# EAGLE schematic e44 (EAGLE 9.5.2)
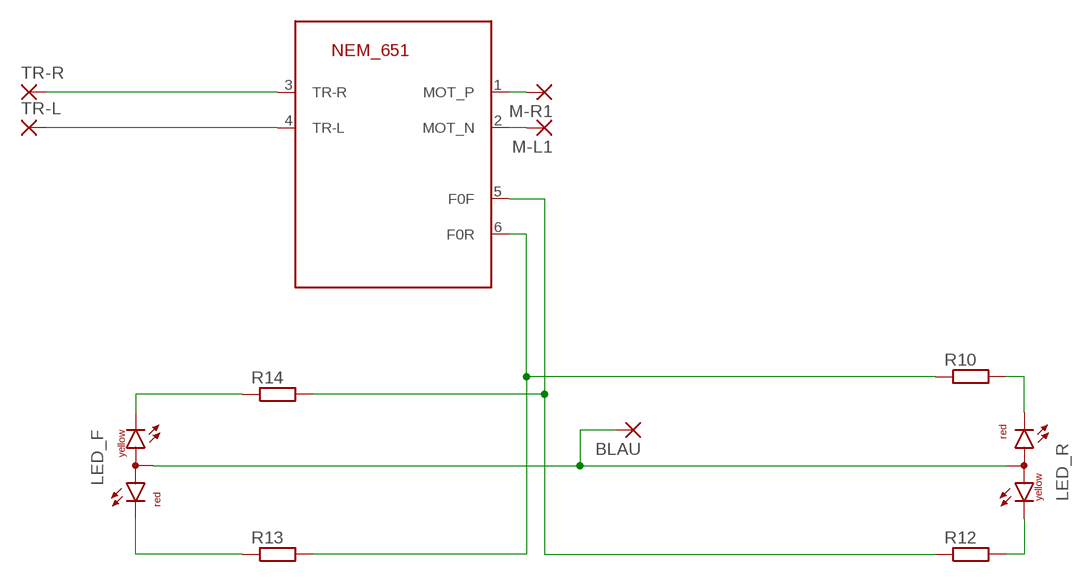
[diagram p0: schematic, sheet 1]

## Parts
651  NEM_651-TS  [53047-06]
BLAU  1,6/0,8  [1,6/0,8]
LED_F  DUOLED-RY-A  [DUOLED-A-5MM]
LED_R  DUOLED-RY-A  [DUOLED-A-5MM]
M-L1  SMD5  [SMD2,54-5,08]
M-R1  SMD5  [SMD2,54-5,08]
R10  R-EU_R1206  [R1206]
R12  R-EU_R1206  [R1206]
R13  R-EU_R1206  [R1206]
R14  R-EU_R1206  [R1206]
TR-L  SMD5  [SMD2,54-5,08]
TR-R  SMD5  [SMD2,54-5,08]

## Nets
N$2: BLAU.1(P) LED_F.A LED_R.A
N$4: 651.4(TR-L) TR-L.1(P)
N$11: 651.3(TR-R) TR-R.1(P)
N$13: 651.5(F0F) R12.1 R14.2
N$15: LED_R.CR R10.2
N$16: LED_R.CX(CY) R12.2
N$17: 651.6(F0R) R10.1 R13.2
N$18: LED_F.CR R13.1
N$19: LED_F.CX(CY) R14.1
N$20: 651.1(MOT_P) M-R1.1(P)
N$21: 651.2(MOT_N) M-L1.1(P)

## Library data of the parts
651 = con-nem:NEM_651: NEM651 Decoder Plug
BLAU = wirepad:1,6/0,8: THROUGH-HOLE PAD
LED_F LED_R = led:DUOLED-RY-A: DUO LED 2 colors (red/yellow), 5 mm, round, common Anode www.ligitek.com or other producers.
M-L1 M-R1 TR-L TR-R = wirepad:SMD5: SMD PAD
R10 R12-R14 = rcl:R-EU_: RESISTOR, European symbol; SPICEPREFIX: R